# Altium schematic sheet ZOWI_Main_Board_Autoreset.SchDoc: Autoreset
size A4; Author: Raúl de Pablos; CompanyName: bq - Mundo Reader; Organization: bq - Mundo Reader; DocumentNumber: 8; Revision: 1.0; SheetNumber: 8; SheetTotal: 9; ProjectName: ZOWI_Main_Board
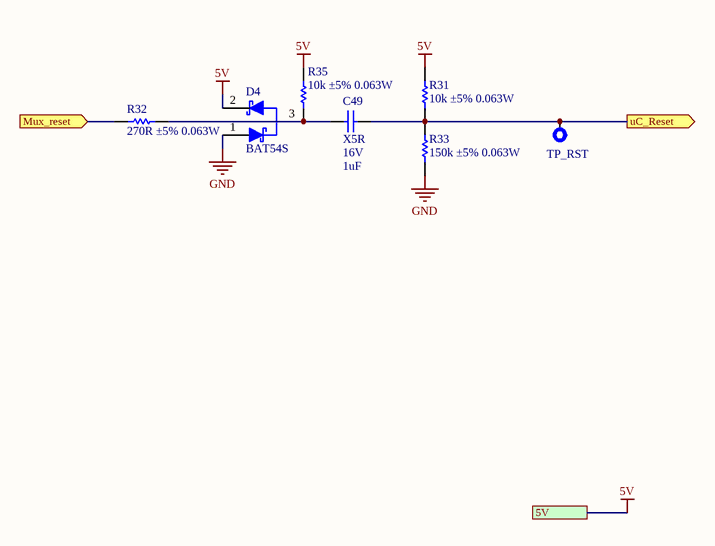
[diagram p0: ZOWI_Main_Board_Autoreset.SchDoc]

## Parts
C49  Dielectric: X5R  Voltage: 16V  Capacitance: 1uF  [C0603]  (hidden comment: Capacitor)
D4  BAT54S  [SOT23-3]
R31  value 10k ±5% 0.063W  [R0402]  (hidden comment: Resistor)
R32  value 270R ±5% 0.063W  [R0402]  (hidden comment: Resistor)
R33  value 150k ±5% 0.063W  [R0402]  (hidden comment: Resistor)
R35  value 10k ±5% 0.063W  [R0402]  (hidden comment: Resistor)
TP_RST  Testpoint  [TP_SMD_1mm]  (value not drawn)  (no BOM)

## Ports
5V, Mux_reset (in), uC_Reset (out)

## Nets
5V: D4.2(K2) R31.2 R35.2 ; port 5V
GND: D4.1(A) R33.1
Mux_reset: R32.1 ; port Mux_reset
uC_Reset: C49.2 R31.1 R33.2 TP_RST.1 ; port uC_Reset
NetC49_1: C49.1 D4.3(K1) R32.2 R35.1

## Notes on the sheet
- Title
- Project
- Size:
- Author
- A4
- Number:
- Revision:
- Mundo Reader, S.L. All rights reserved. No part of these pages, either text or image may be used for any purpose other than personal use. Therefore, reproduction, modification, storage in a retrieval system or retransmission, in any form or by any means, electronic, mechanical or otherwise, for reasons other than personal use, is strictly prohibited without prior written permission.
- Date:
- Time:
- Sheet
- of

## Library data of the parts
C49 = C0603_1uF_16V_±10%: Capacitor SMD; Manufacturer: Kemet; Value: 1uF ±10% 16V; Tolerance: ±10%; OrderingCode: C0603C105K4PAC; Temp_ Max: 125; Temp_ Min: -55; Part Number: C0603_1uF_16V_±10%
D4 = BAT54S: Dual Schottky Diode; Manufacturer: NXP; Ifor: 200mA; Vrrm: 30V; Ifsm: 600mA; Vf: 0,8V; Temp_ Max: 150; Temp_ Min: -55; Value: 200mA 30V; Part Number: BAT54S; OrderingCode: BAT54S; Manufacturer 2: Vishay; OrderingCode 2: BAT54S
R31 R35 = R0402_10k_0.063W_±5%: Resistor, SMD; Manufacturer: Vishay; Tolerance: ±5%; OrderingCode: CRCW040210K0JN; Power: 0.063W; Resistance: 10k; Temp_ Max: 155; Temp_ Min: -55; PackageDescription: SMD; Part Number: R0402_10k_0.063W_±5%
R32 = R0402_270R_0.063W_±5%: Resistor, SMD; Manufacturer: Vishay; Tolerance: ±5%; OrderingCode: CRCW0402270RJN; Power: 0.063W; Resistance: 270R; Temp_ Max: 155; Temp_ Min: -55; PackageDescription: SMD; Part Number: R0402_270R_0.063W_±5%
R33 = R0402_150k_0.063W_±5%: Resistor, SMD; Manufacturer: Vishay; Tolerance: ±5%; OrderingCode: CRCW0402150KJN; Power: 0.063W; Resistance: 150k; Temp_ Max: 155; Temp_ Min: -55; PackageDescription: SMD; Part Number: R0402_150k_0.063W_±5%
TP_RST = TP_SMD_1mm: Manufacturer: Oxley; OrderingCode: SMOX/060/B1; SAP: 303552; Part Number: TP_SMD_1mm